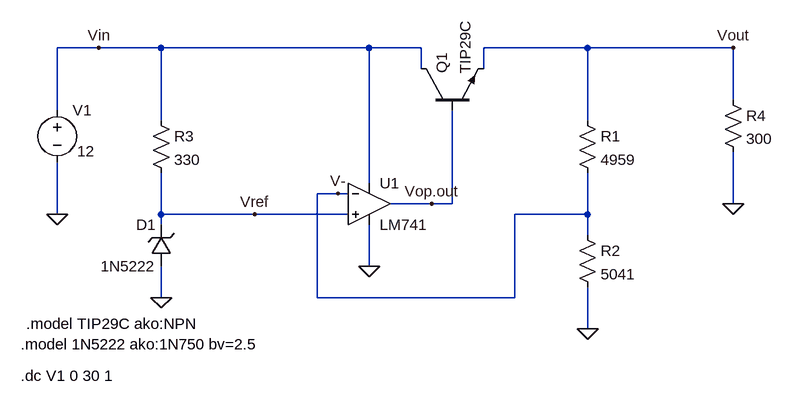
[diagram p0: schematic VReg.asc]
VReg.asc, the LTspice schematic file:
Version 4
SHEET 1 880 680
WIRE -432 -48 -496 -48
WIRE -336 -48 -432 -48
WIRE -16 -48 -336 -48
WIRE 64 -48 -16 -48
WIRE 320 -48 160 -48
WIRE 544 -48 320 -48
WIRE 64 -16 64 -48
WIRE 160 -16 160 -48
WIRE 544 32 544 -48
WIRE -496 48 -496 -48
WIRE -336 64 -336 -48
WIRE 320 64 320 -48
WIRE -16 160 -16 -48
WIRE -64 176 -96 176
WIRE -48 176 -64 176
WIRE 80 192 16 192
WIRE 112 192 112 48
WIRE 112 192 80 192
WIRE 544 192 544 112
WIRE -496 208 -496 128
WIRE -336 208 -336 144
WIRE -192 208 -336 208
WIRE -48 208 -192 208
WIRE 320 208 320 144
WIRE 320 208 208 208
WIRE -336 224 -336 208
WIRE 320 240 320 208
WIRE -16 288 -16 224
WIRE -336 336 -336 288
WIRE -96 336 -96 176
WIRE 208 336 208 208
WIRE 208 336 -96 336
WIRE 320 384 320 320
FLAG -336 336 0
FLAG 320 384 0
FLAG 544 192 0
FLAG -496 208 0
FLAG -192 208 Vref
FLAG -64 176 V-
FLAG 80 192 Vop.out
FLAG 544 -48 Vout
FLAG -432 -48 Vin
FLAG -16 288 0
SYMBOL res 304 48 R0
SYMATTR InstName R1
SYMATTR Value 4959
SYMBOL res 304 224 R0
SYMATTR InstName R2
SYMATTR Value 5041
SYMBOL res -352 48 R0
SYMATTR InstName R3
SYMATTR Value 330
SYMBOL OpAmps\\LM741 -16 128 R0
SYMATTR InstName U1
SYMBOL npn 64 48 R270
SYMATTR InstName Q1
SYMATTR Value TIP29C
SYMBOL zener -320 288 R180
WINDOW 0 24 64 Left 2
WINDOW 3 24 0 Left 2
SYMATTR InstName D1
SYMATTR Value 1N5222
SYMBOL res 528 16 R0
SYMATTR InstName R4
SYMATTR Value 300
SYMBOL voltage -496 32 R0
WINDOW 123 0 0 Left 0
WINDOW 39 0 0 Left 0
WINDOW 3 31 79 Left 2
SYMATTR InstName V1
SYMATTR Value 12
TEXT -552 408 Left 2 !.model 1N5222 ako:1N750 bv=2.5
TEXT -544 376 Left 2 !.model TIP29C ako:NPN
TEXT -552 456 Left 2 !.dc V1 0 30 1

The netlist it stands for:
* VReg.asc
R1 Vout V- 4959
R2 V- 0 5041
R3 Vin Vref 330
XU1 Vref V- Vin 0 Vop.out LM741  ; pins In+ In- V+ V- OUT
Q1 Vin Vop.out Vout 0 TIP29C
D1 0 Vref 1N5222
R4 Vout 0 300
V1 Vin 0 12
.model D D
.lib standard.dio
.model NPN NPN
.model PNP PNP
.lib standard.bjt
.model 1N5222 ako:1N750 bv=2.5
.model TIP29C ako:NPN
.dc V1 0 30 1
.lib LM741.lib
.backanno
.end